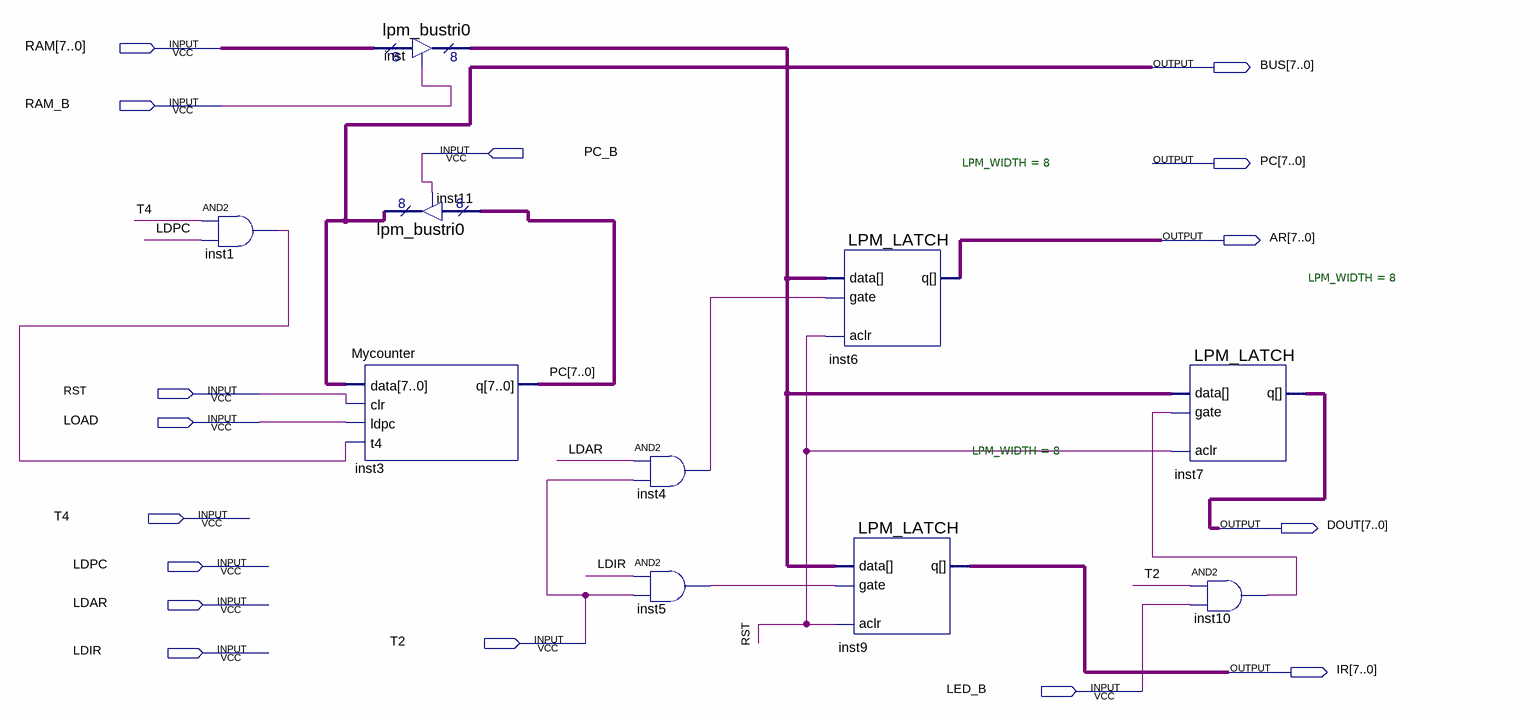
[diagram p0: schematic sheet]
// Quartus schematic REGSMD.bdf as structural Verilog: 10 symbols, 16 pins
module REGSMD (
  input  [7:0] RAM,
  input  RAM_B,
  input  PC_B,
  input  RST,
  input  LOAD,
  input  T4,
  input  LDPC,
  input  LDAR,
  input  T2,
  input  LDIR,
  input  LED_B,
  output [7:0] BUS,
  output [7:0] PC,
  output [7:0] AR,
  output [7:0] DOUT,
  output [7:0] IR
);

  wire inst1_out, inst4_out, inst5_out, inst10_out;

  and inst1 (inst1_out, T4, LDPC);
  Mycounter inst3 (.data(BUS), .clr(RST), .ldpc(LOAD), .t4(inst1_out), .q(PC));
  lpm_bustri0 inst (.enabledt(RAM_B), .data(RAM), .tridata(BUS));
  lpm_bustri0 inst11 (.enabledt(PC_B), .data(PC), .tridata(BUS));
  and inst4 (inst4_out, LDAR, T2);
  and inst5 (inst5_out, LDIR, T2);
  LPM_LATCH #(.LPM_WIDTH(8)) inst6 (.aclr(RST), .data(BUS), .gate(inst4_out), .q(AR));
  LPM_LATCH #(.LPM_WIDTH(8)) inst9 (.aclr(RST), .data(BUS), .gate(inst5_out), .q(IR));
  LPM_LATCH #(.LPM_WIDTH(8)) inst7 (.aclr(RST), .data(BUS), .gate(inst10_out), .q(DOUT));
  and inst10 (inst10_out, T2, LED_B);
endmodule
